# Altium schematic sheet KeepTalkingV2_SevenSeg.SchDoc
size A; SheetNumber: 2; SheetTotal: 2
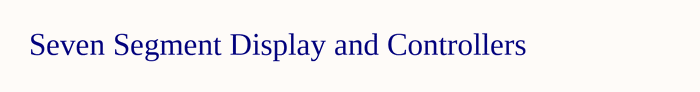
[diagram p0: KeepTalkingV2_SevenSeg.SchDoc]

## Notes on the sheet
- Seven Segment Display and Controllers